# EAGLE design mainboard (EAGLE 6.4)
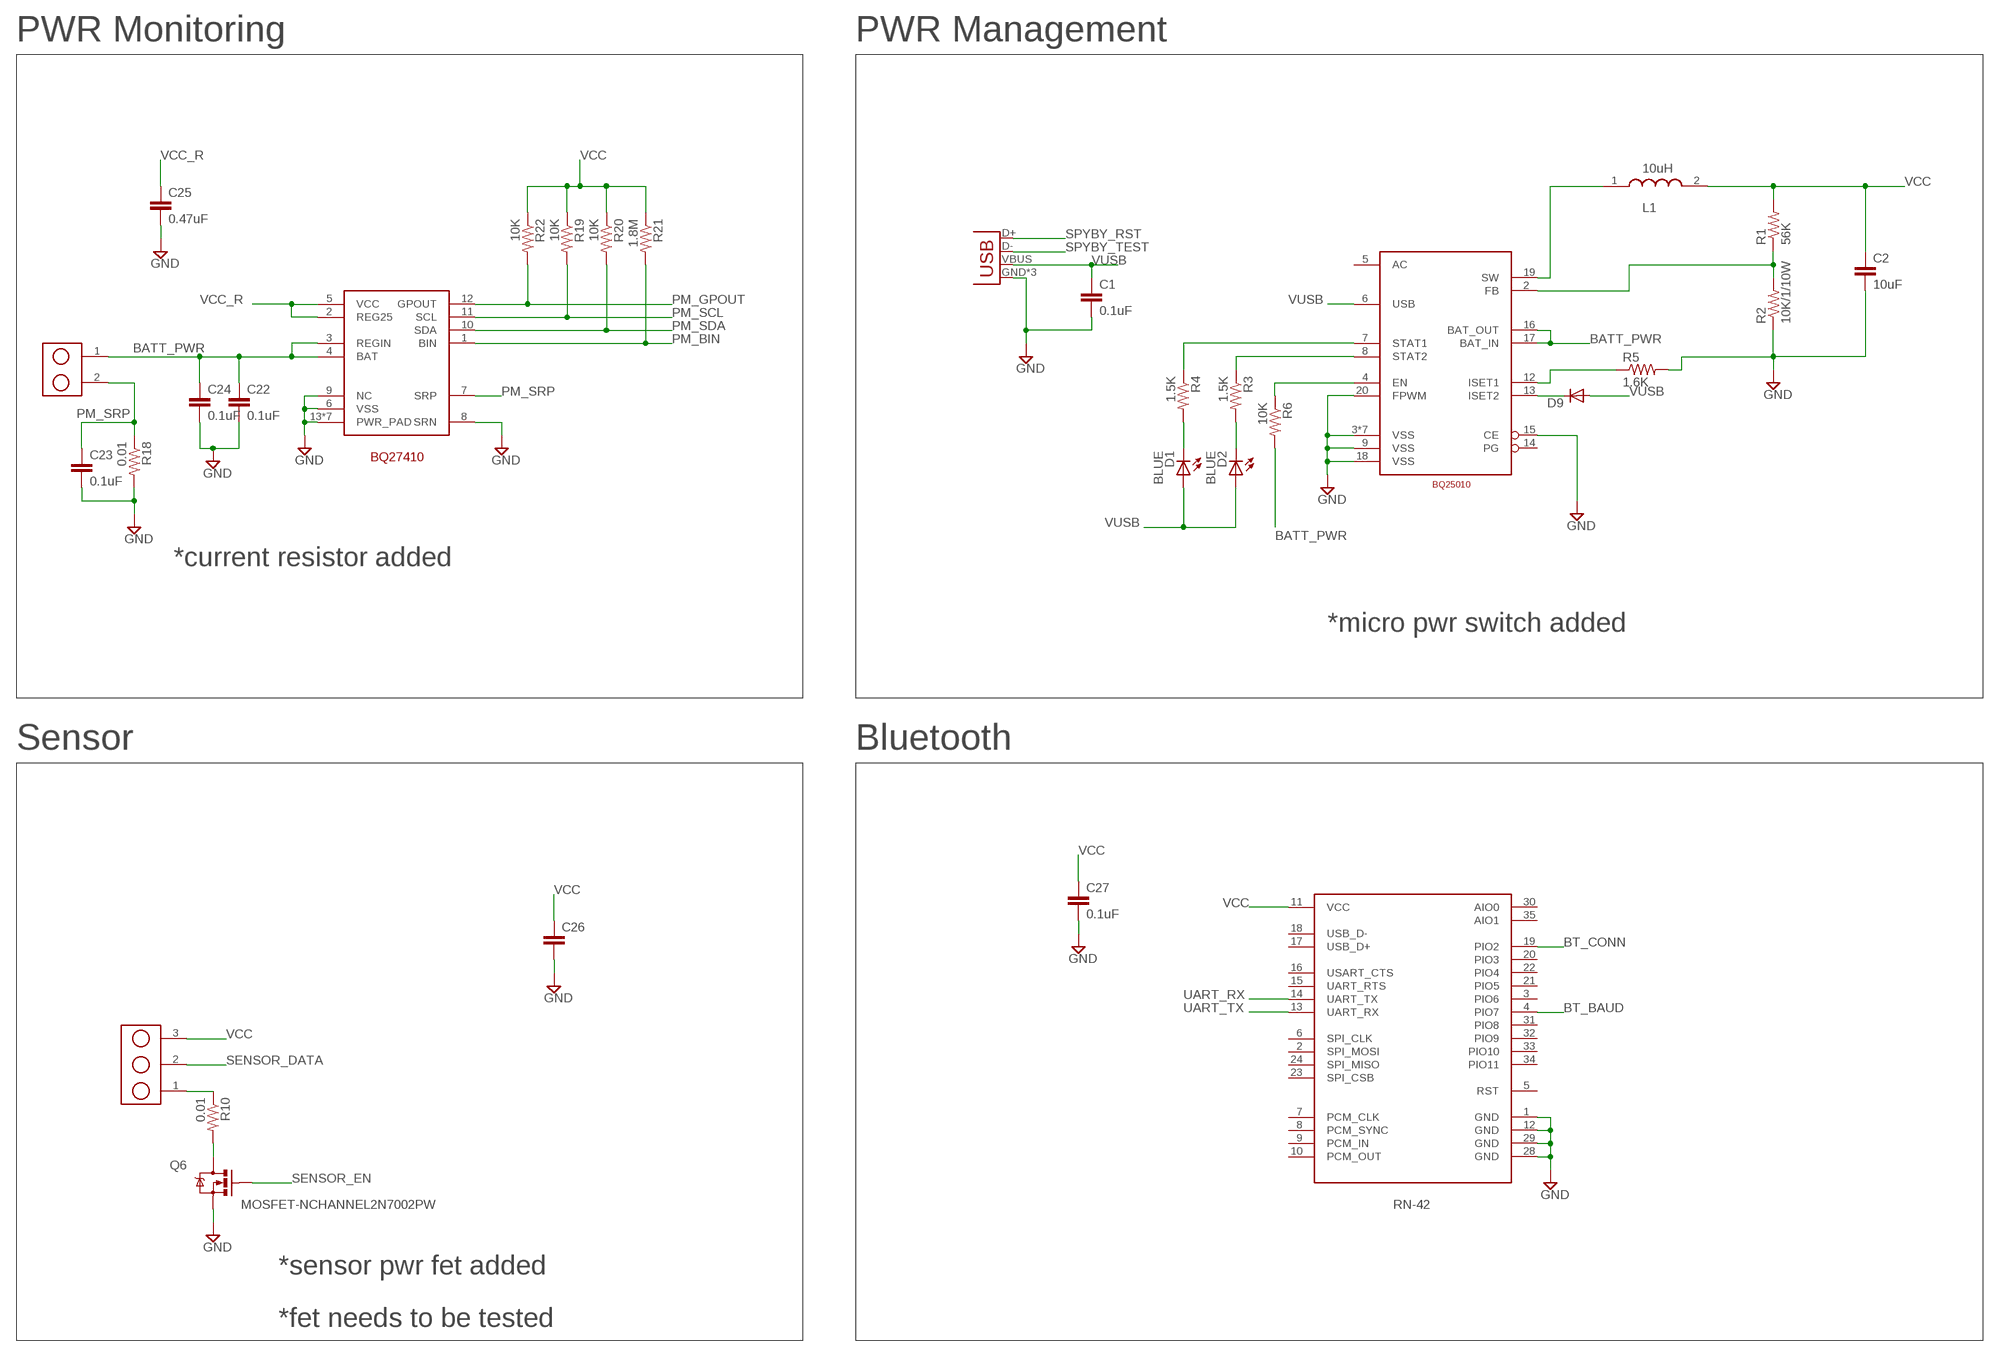
[diagram p0: schematic, sheet 1, part 1 of 2]
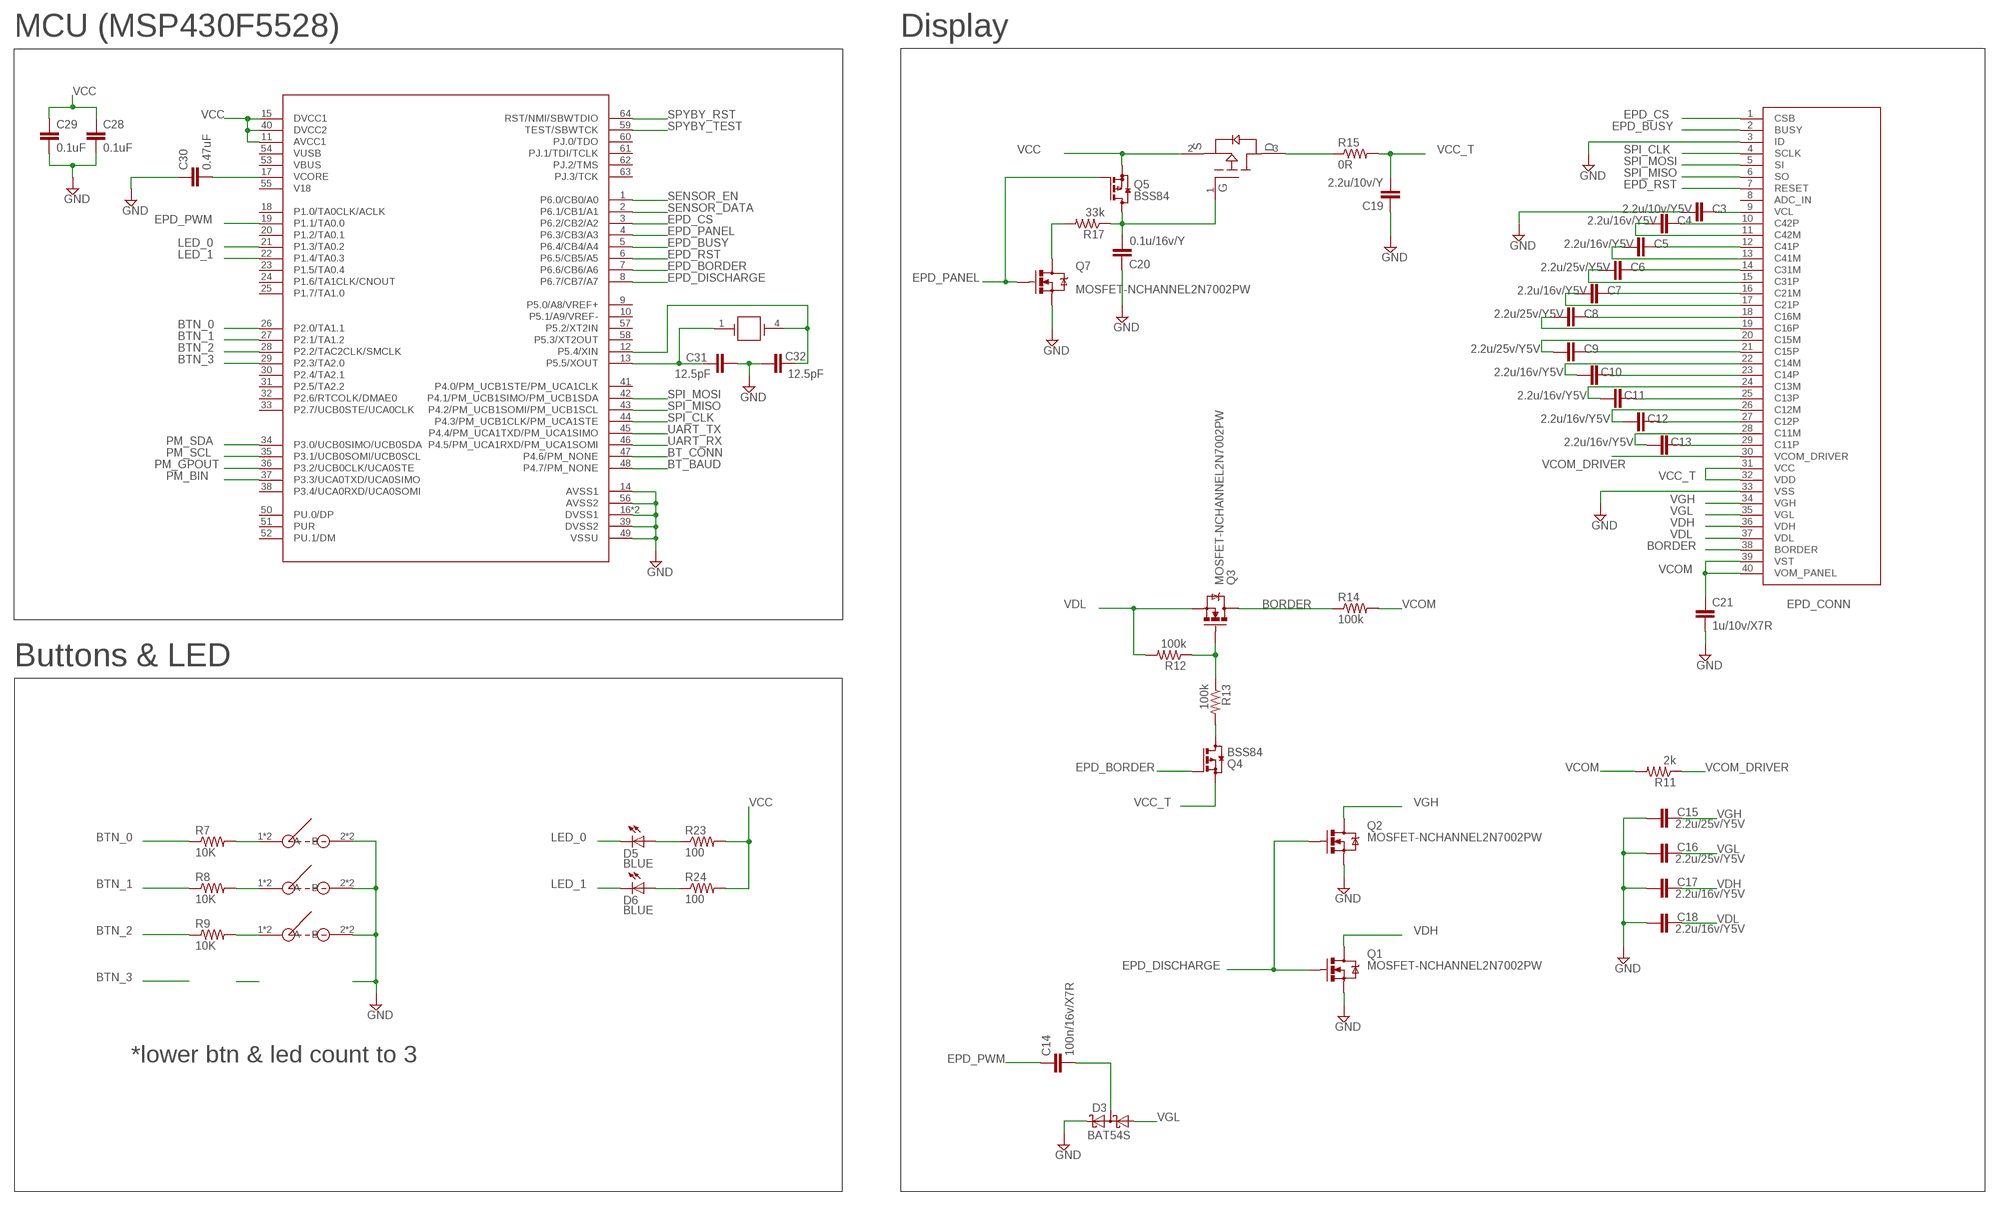
[diagram p1: schematic, sheet 1, part 2 of 2]

## Parts
AP2305  DMG2305UX  [SOT23]
C1  0.1uF  CAP0402-CAP  [0402-CAP]
C2  10uF  CAP0402-CAP  [0402-CAP]
C3  2.2u/10v/Y5V  CAP0402-CAP  [0402-CAP]
C4  2.2u/16v/Y5V  CAP0402-CAP  [0402-CAP]
C5  2.2u/16v/Y5V  CAP0402-CAP  [0402-CAP]
C6  2.2u/25v/Y5V  CAP0402-CAP  [0402-CAP]
C7  2.2u/16v/Y5V  CAP0402-CAP  [0402-CAP]
C8  2.2u/25v/Y5V  CAP0402-CAP  [0402-CAP]
C9  2.2u/25v/Y5V  CAP0402-CAP  [0402-CAP]
C10  2.2u/16v/Y5V  CAP0402-CAP  [0402-CAP]
C11  2.2u/16v/Y5V  CAP0402-CAP  [0402-CAP]
C12  2.2u/16v/Y5V  CAP0402-CAP  [0402-CAP]
C13  2.2u/16v/Y5V  CAP0402-CAP  [0402-CAP]
C14  100n/16v/X7R  CAP0402-CAP  [0402-CAP]
C15  2.2u/25v/Y5V  CAP0402-CAP  [0402-CAP]
C16  2.2u/25v/Y5V  CAP0402-CAP  [0402-CAP]
C17  2.2u/16v/Y5V  CAP0402-CAP  [0402-CAP]
C18  2.2u/16v/Y5V  CAP0402-CAP  [0402-CAP]
C19  2.2u/10v/Y  CAP0402-CAP  [0402-CAP]
C20  0.1u/16v/Y  CAP0402-CAP  [0402-CAP]
C21  1u/10v/X7R  CAP0402-CAP  [0402-CAP]
C22  0.1uF  CAP0402-CAP  [0402-CAP]
C23  0.1uF  CAP0402-CAP  [0402-CAP]
C24  0.1uF  CAP0402-CAP  [0402-CAP]
C25  0.47uF  CAP0402-CAP  [0402-CAP]
C26  CAP0402-CAP  [0402-CAP]
C27  0.1uF  CAP0402-CAP  [0402-CAP]
C28  0.1uF  CAP0402-CAP  [0402-CAP]
C29  0.1uF  CAP0402-CAP  [0402-CAP]
C30  0.47uF  CAP0402-CAP  [0402-CAP]
C31  12.5pF  CAP0402-CAP  [0402-CAP]
C32  12.5pF  CAP0402-CAP  [0402-CAP]
D1  BLUE  LED-BLUE0603  [LED-0603]
D2  BLUE  LED-BLUE0603  [LED-0603]
D3  BAT54S  [SOT23]
D5  BLUE  LED-BLUE0603  [LED-0603]
D6  BLUE  LED-BLUE0603  [LED-0603]
D9  DIODESOD523  [SOD523]
JP1  USB-MICROB  [USB-MICROB]
L1  10uH  ASPI-0428S-100M-T  [ASPI_0428S-100M-T]
Q1  MOSFET-NCHANNEL2N7002PW  [SOT323]
Q2  MOSFET-NCHANNEL2N7002PW  [SOT323]
Q3  MOSFET-NCHANNEL2N7002PW  [SOT323]
Q4  BSS84  [SOT23]
Q5  BSS84  [SOT23]
Q6  MOSFET-NCHANNEL2N7002PW  [SOT323]
Q7  MOSFET-NCHANNEL2N7002PW  [SOT323]
R1  56K  RESISTOR0402-RES  [0402-RES]
R2  10K/1/10W  RESISTOR0402-RES  [0402-RES]
R3  1.5K  RESISTOR0402-RES  [0402-RES]
R4  1.5K  RESISTOR0402-RES  [0402-RES]
R5  1.6K  RESISTOR0402-RES  [0402-RES]
R6  10K  RESISTOR0402-RES  [0402-RES]
R7  10K  RESISTOR0402-RES  [0402-RES]
R8  10K  RESISTOR0402-RES  [0402-RES]
R9  10K  RESISTOR0402-RES  [0402-RES]
R10  0.01  RESISTOR0402-RES  [0402-RES]
R11  2k  RESISTOR0402-RES  [0402-RES]
R12  100k  RESISTOR0402-RES  [0402-RES]
R13  100k  RESISTOR0402-RES  [0402-RES]
R14  100k  RESISTOR0402-RES  [0402-RES]
R15  0R  RESISTOR0402-RES  [0402-RES]
R17  33k  RESISTOR0402-RES  [0402-RES]
R18  0.01  RESISTOR0402-RES  [0402-RES]
R19  10K  RESISTOR0402-RES  [0402-RES]
R20  10K  RESISTOR0402-RES  [0402-RES]
R21  1.8M  RESISTOR0402-RES  [0402-RES]
R22  10K  RESISTOR0402-RES  [0402-RES]
R23  100  RESISTOR0402-RES  [0402-RES]
R24  100  RESISTOR0402-RES  [0402-RES]
U$1  MSP430F5528  [VQFN_RGC_64PIN]
U$2  RN-42  [RN-42]
U$3  BQ25010  [VQFN_RHL_20PIN]
U$4  RA_TAC_BUTTON"EVQPUK"  [EVQ-PUK02K]
U$5  RA_TAC_BUTTON"EVQPUK"  [EVQ-PUK02K]
U$6  RA_TAC_BUTTON"EVQPUK"  [EVQ-PUK02K]
U$8  FH12-40S-0.5SH  [FH12-40S-0.5SH]
U$9  BQ27410  [SON_DRZ_12PIN]
U$11  HEADER_2PIN_50MIL  [HEADER_2PIN_50MIL]
U$12  HEADER_3PIN_50MIL  [HEADER_3PIN_50MIL]
X1  CRYSTAL"32.768"  [ECS-327-12.5-17X-C-TR]

## Nets
BATT_PWR: C22.1 C24.1 R6.2 U$3.16(BAT_OUT) U$3.17(BAT_IN) U$9.3(REGIN) U$9.4(BAT) U$11.1
BORDER: Q3.3(D) R14.1 U$8.38(BORDER)
BT_BAUD: U$1.48(P4.7/PM_NONE) U$2.4(PIO7)
BT_CONN: U$1.47(P4.6/PM_NONE) U$2.19(PIO2)
BTN_0: R7.1 U$1.26(P2.0/TA1.1)
BTN_1: R8.1 U$1.27(P2.1/TA1.2)
BTN_2: R9.1 U$1.28(P2.2/TAC2CLK/SMCLK)
BTN_3: U$1.29(P2.3/TA2.0)
EPD_BORDER: Q4.1(G) U$1.7(P6.6/CB6/A6)
EPD_BUSY: U$1.5(P6.4/CB4/A4) U$8.2(BUSY)
EPD_CS: U$1.3(P6.2/CB2/A2) U$8.1(CSB)
EPD_DISCHARGE: Q1.1(G) Q2.1(G) U$1.8(P6.7/CB7/A7)
EPD_PANEL: Q5.1(G) Q7.1(G) U$1.4(P6.3/CB3/A3)
EPD_PWM: C14.1 U$1.19(P1.1/TA0.0)
EPD_RST: U$1.6(P6.5/CB5/A5) U$8.7(RESET)
GND: C1.2 C2.2 C3.1 C15.1 C16.1 C17.1 C18.1 C19.1 C20.1 C21.2 C22.2 C23.2 C24.2 C25.2 C26.2 C27.2 C28.2 C29.2 C30.1 C31.2 C32.1 D3.2(C2) JP1.GND JP1.MT1(GND) JP1.MT2(GND) Q1.2(S) Q2.2(S) Q6.2(S) Q7.2(S) R2.1 R5.2 R18.2 U$1.14(AVSS1) U$1.16(DVSS1) U$1.39(DVSS2) U$1.49(VSSU) U$1.56(AVSS2) U$1.P$1(DVSS1) U$2.1(GND) U$2.12(GND) U$2.28(GND) U$2.29(GND) U$3.3(VSS) U$3.9(VSS) U$3.15(CE) U$3.18(VSS) U$3.20(FPWM) U$3.P$21(VSS) U$3.P$22(VSS) U$3.P$23(VSS) U$3.P$24(VSS) U$3.P$25(VSS) U$3.P$26(VSS) U$4.2(B) U$4.4(B) U$5.2(B) U$5.4(B) U$6.2(B) U$6.4(B) U$8.3(ID) U$8.33(VSS) U$9.6(VSS) U$9.8(SRN) U$9.9(NC) U$9.13(PWR_PAD) U$9.P$15(PWR_PAD) U$9.P$16(PWR_PAD) U$9.P$17(PWR_PAD) U$9.P$18(PWR_PAD) U$9.P$19(PWR_PAD) U$9.P$20(PWR_PAD)
LED_0: D5.C U$1.21(P1.3/TA0.2)
LED_1: D6.C U$1.22(P1.4/TA0.3)
N$1: R5.1 U$3.12(ISET1)
N$2: D1.C R4.2
N$3: D9.C U$3.13(ISET2)
N$4: D2.C R3.2
N$5: R1.1 R2.2 U$3.2(FB)
N$6: L1.1 U$3.19(SW)
N$7: C30.2 U$1.17(VCORE)
N$8: Q4.3(D) R13.2
N$9: C14.2 D3.3(C1A2)
N$10: R4.1 U$3.7(STAT1)
N$11: R3.1 U$3.8(STAT2)
N$12: R6.1 U$3.4(EN)
N$13: R7.2 U$4.1(A) U$4.3(A)
N$14: R8.2 U$5.1(A) U$5.3(A)
N$15: R9.2 U$6.1(A) U$6.3(A)
N$17: Q6.3(D) R10.2
N$19: R10.1 U$12.1
N$26: C4.2 U$8.10(C42P)
N$27: C4.1 U$8.11(C42M)
N$28: C5.2 U$8.12(C41P)
N$29: C5.1 U$8.13(C41M)
N$30: C6.2 U$8.14(C31M)
N$31: C6.1 U$8.15(C31P)
N$32: C7.2 U$8.16(C21M)
N$33: C7.1 U$8.17(C21P)
N$34: C8.2 U$8.18(C16M)
N$35: C8.1 U$8.19(C16P)
N$36: C9.1 U$8.20(C15M)
N$37: C9.2 U$8.21(C15P)
N$38: C10.1 U$8.22(C14M)
N$39: C10.2 U$8.23(C14P)
N$40: C11.1 U$8.24(C13M)
N$41: C11.2 U$8.25(C13P)
N$42: C12.1 U$8.26(C12M)
N$43: C12.2 U$8.27(C12P)
N$44: C13.1 U$8.28(C11M)
N$45: C13.2 U$8.29(C11P)
N$46: C3.2 U$8.9(VCL)
N$47: AP2305.3(DRAIN) R15.1
N$48: D5.A R23.1
N$49: Q3.1(G) R12.1 R13.1
N$50: AP2305.1(GATE) C20.2 Q5.3(D) R17.1
N$51: D6.A R24.1
N$52: Q7.3(D) R17.2
PM_BIN: R21.2 U$1.37(P3.3/UCA0TXD/UCA0SIMO) U$9.1(BIN)
PM_GPOUT: R22.2 U$1.36(P3.2/UCB0CLK/UCA0STE) U$9.12(GPOUT)
PM_SCL: R19.2 U$1.35(P3.1/UCB0SOMI/UCB0SCL) U$9.11(SCL)
PM_SDA: R20.2 U$1.34(P3.0/UCB0SIMO/UCB0SDA) U$9.10(SDA)
PM_SRP: C23.1 R18.1 U$9.7(SRP) U$11.2
SENSOR_DATA: U$1.2(P6.1/CB1/A1) U$12.2
SENSOR_EN: Q6.1(G) U$1.1(P6.0/CB0/A0)
SPI_CLK: U$1.44(P4.3/PM_UCB1CLK/PM_UCA1STE) U$8.4(SCLK)
SPI_MISO: U$1.43(P4.2/PM_UCB1SOMI/PM_UCB1SCL) U$8.6(SO)
SPI_MOSI: U$1.42(P4.1/PM_UCB1SIMO/PM_UCB1SDA) U$8.5(SI)
SPYBY_RST: JP1.D+ U$1.64(RST/NMI/SBWTDIO)
SPYBY_TEST: JP1.D- U$1.59(TEST/SBWTCK)
UART_RX: U$1.46(P4.5/PM_UCA1RXD/PM_UCA1SOMI) U$2.14(UART_TX)
UART_TX: U$1.45(P4.4/PM_UCA1TXD/PM_UCA1SIMO) U$2.13(UART_RX)
VCC: AP2305.2(SOURCE) C2.1 C26.1 C27.1 C28.1 C29.1 L1.2 Q5.2(S) R1.2 R19.1 R20.1 R21.1 R22.1 R23.2 R24.2 U$1.11(AVCC1) U$1.15(DVCC1) U$1.40(DVCC2) U$2.11(VCC) U$12.3
VCC_R: C25.1 U$9.2(REG25) U$9.5(VCC)
VCC_T: C19.2 Q4.2(S) R15.2 U$8.31(VCC) U$8.32(VDD)
VCOM: C21.1 R11.2 R14.2 U$8.39(VST) U$8.40(VOM_PANEL)
VCOM_DRIVER: R11.1 U$8.30(VCOM_DRIVER)
VDH: C17.2 Q1.3(D) U$8.36(VDH)
VDL: C18.2 Q3.2(S) R12.2 U$8.37(VDL)
VGH: C15.2 Q2.3(D) U$8.34(VGH)
VGL: C16.2 D3.1(A1) U$8.35(VGL)
VUSB: C1.1 D1.A D2.A D9.A JP1.VBUS U$3.6(USB)
XIN: C32.2 U$1.12(P5.4/XIN) X1.4
XOUT: C31.1 U$1.13(P5.5/XOUT) X1.1
Unconnected: U$1.9(P5.0/A8/VREF+) U$1.10(P5.1/A9/VREF-) U$1.18(P1.0/TA0CLK/ACLK) U$1.20(P1.2/TA0.1) U$1.23(P1.5/TA0.4) U$1.24(P1.6/TA1CLK/CNOUT) U$1.25(P1.7/TA1.0) U$1.30(P2.4/TA2.1) U$1.31(P2.5/TA2.2) U$1.32(P2.6/RTCOLK/DMAE0) U$1.33(P2.7/UCB0STE/UCA0CLK) U$1.38(P3.4/UCA0RXD/UCA0SOMI) U$1.41(P4.0/PM_UCB1STE/PM_UCA1CLK) U$1.50(PU.0/DP) U$1.51(PUR) U$1.52(PU.1/DM) U$1.53(VBUS) U$1.54(VUSB) U$1.55(V18) U$1.57(P5.2/XT2IN) U$1.58(P5.3/XT2OUT) U$1.60(PJ.0/TDO) U$1.61(PJ.1/TDI/TCLK) U$1.62(PJ.2/TMS) U$1.63(PJ.3/TCK) U$2.2(SPI_MOSI) U$2.3(PIO6) U$2.5(RST) U$2.6(SPI_CLK) U$2.7(PCM_CLK) U$2.8(PCM_SYNC) U$2.9(PCM_IN) U$2.10(PCM_OUT) U$2.15(UART_RTS) U$2.16(USART_CTS) U$2.17(USB_D+) U$2.18(USB_D-) U$2.20(PIO3) U$2.21(PIO5) U$2.22(PIO4) U$2.23(SPI_CSB) U$2.24(SPI_MISO) U$2.30(AIO0) U$2.31(PIO8) U$2.32(PIO9) U$2.33(PIO10) U$2.34(PIO11) U$2.35(AIO1) U$3.5(AC) U$3.14(PG) U$8.8(ADC_IN)

## Notes on the sheet
- PWR Monitoring | PWR Management | MCU (MSP430F5528) | Display
- 10uH
- L1
- *current resistor added
- *micro pwr switch added
- Sensor | Bluetooth | Buttons & LED
- *lower btn & led count to 3
- *sensor pwr fet added
- *fet needs to be tested

## Library data of the parts
AP2305 = TuansLib:DMG2305UX
C1-C32 = SparkFun-Capacitors:CAP: Capacitor Standard 0603 ceramic capacitor, and 0.1" leaded capacitor.
D1 D2 D5 D6 = SparkFun-LED:LED-BLUE: Blue LEDs for production use Various blue LEDs stocked by SparkFun production 0603 - DIO-08575 Rebel - DIO-09553 1206 - DIO-09911; PROD_ID: DIO-08575
D3 = diode:BAT54S: Schottky Diodes Pin connection corrected 2011-05-04 Source: Fairchild .. BAT54.pdf
D9 = SparkFun-DiscreteSemi:DIODE: Diode These are standard reverse protection diodes and small signal diodes. SMA package can handle up to about 1A. SOD-323 can handle about 200mA. What the SOD-323 package when ordering, there are some mfgs out there that are 5-pin packages.
JP1 = SparkFun-Connectors:USB: USB Connectors USB-B-PTH is fully proven SKU : PRT-00139/CONN-08278 USB-miniB is fully proven SKU : PRT-00587 USB-A-PCB is untested. USB-A-H is throughly reviewed, but untested. Spark Fun Electronics SKU : PRT-00437 USB-B-SMT is throughly reviewed, but untested. Needs silkscreen touching up. USB-A-S has not been used/tested USB-MB-H has not been used/tested USB-MICROB has been used. CONN-09505; PROD_ID: CONN-09505
L1 = TuansLib:ASPI-0428S-100M-T
Q1-Q3 Q6 Q7 = SparkFun-DiscreteSemi:MOSFET-NCHANNEL: Common NMOSFET Parts MFG P/N Store ID Prod ID FDD8780 TRANS-09984 SI7820DN TRANS-11055 FDS6630A IC-08089 2N7002PW TRANS-11151 FQP30N06L COM-10213 TRANS-10060 BSS123LT1G TRANS-08345 BSS138 TRANS-00830 BS170 2N7000; PROD_ID: TRANS-11151
Q4 Q5 = transistor-small-signal:BSS84: P-CHANNEL MOS FET
R1-R15 R17-R24 = SparkFun-Passives:RESISTOR: Resistor Basic schematic elements and footprints for 0603, 1206, and PTH resistors.
U$1 = TuansLib:MSP430F5528
U$2 = TuansLib:RN-42
U$3 = TuansLib:BQ25010
U$4-U$6 = TuansLib:RA_TAC_BUTTON; PART#: EVQ-PUK02K
U$8 = TuansLib:FH12-40S-0.5SH
U$9 = TuansLib:BQ27410
U$11 = TuansLib:HEADER_2PIN_50MIL
U$12 = TuansLib:HEADER_3PIN_50MIL
X1 = TuansLib:CRYSTAL

## Board
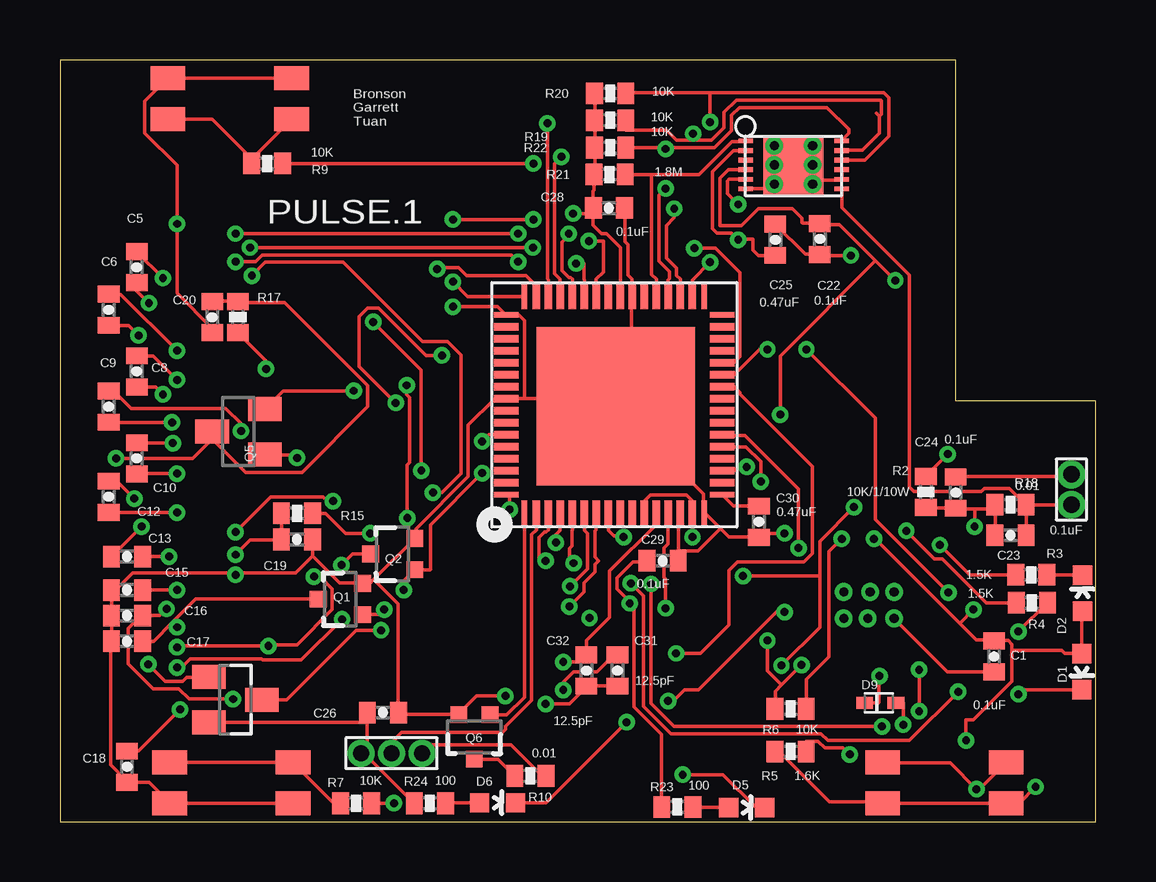
[diagram p2: board, top side]
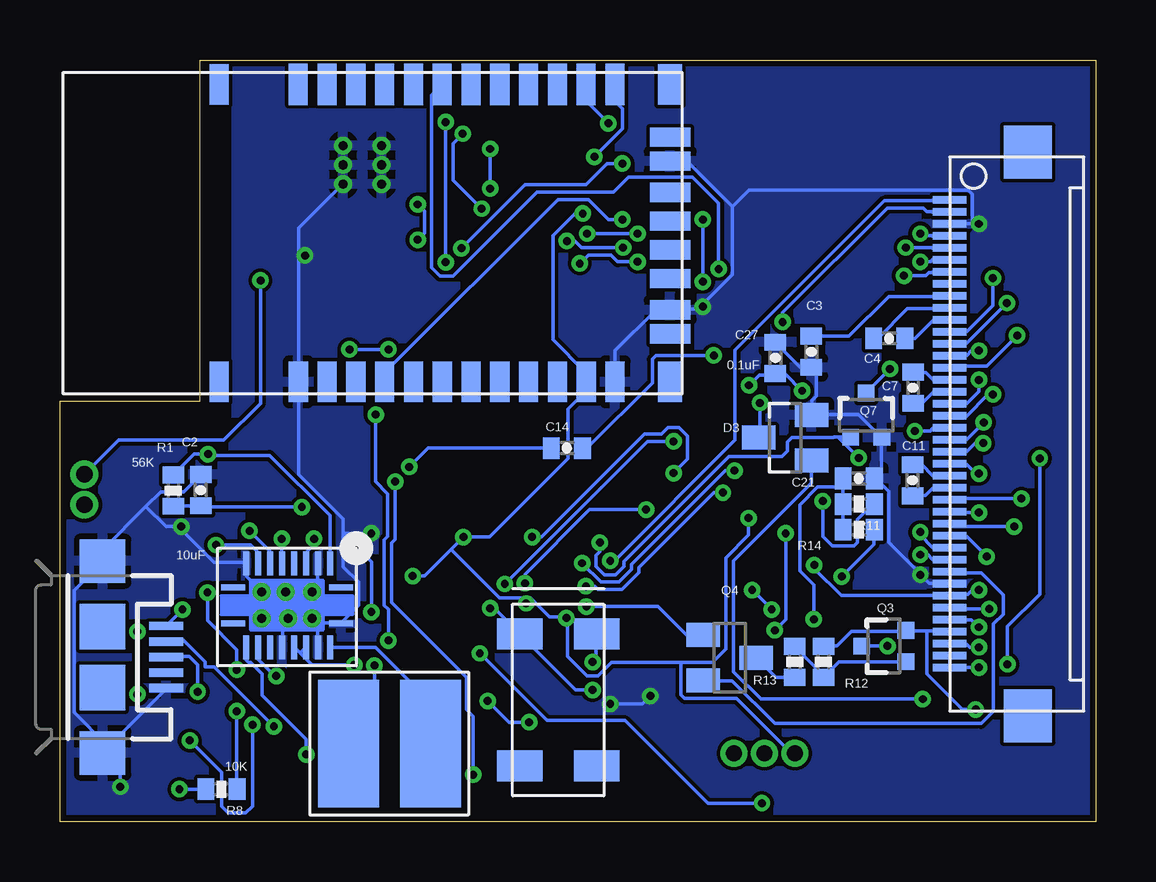
[diagram p3: board, bottom side, seen from below]

Size 43.18 x 31.75 mm. Coordinates in mm from the lower left corner, seen from the top.
Outline: 37.34,31.75 0,31.75 0,0 43.18,0 43.18,17.53 37.34,17.53 37.34,31.75
Copper layers (1*16): Top 0.035mm / dielectric 1.5mm / Bottom 0.035mm
Design rules "default *": minimum track width 6mil, minimum drill 13mil, track to track 6mil, track to pad 6mil, pad to pad 6mil, via to via 6mil, smd to smd 6mil, copper to edge 10mil, drill to drill 8mil, minimum pad ring 7mil, minimum via ring 7mil, stop-mask expansion 4mil, vias tented up to drill 0mil, thermal gap 10mil

### Footprints (pad centres in the part's own frame; a part is rotated, then mirrored left to right if it is on the bottom)
SOT23 = smd 1 x 1.4: 1 -0.95,-1.1; 2 0.95,-1.1; 3 0,1.1
0402-CAP = smd 0.7 x 0.9: 1 -0.65,0; 2 0.65,0
LED-0603 = smd 0.8 x 0.8: A 0,-0.75; C 0,0.75
SOD523 = smd 0.7 x 0.5: A 0.7,0; C -0.6,0
USB-MICROB = smd 0.35 x 1.4: D+ 0,2.65; D- -0.65,2.65; GND 1.3,2.65; ID 0.65,2.65; VBUS -1.3,2.65 | smd 1.8 x 1.9: MT1 -4,0; MT2 4,0 | smd 1.9 x 1.9: P$1 -1.27,0; P$2 1.27,0
ASPI_0428S-100M-T = smd 5.309 x 2.54: 1 0,0; 2 0,3.404
SOT323 = smd 0.7 x 0.7: 1 -0.65,-0.925; 2 0.65,-0.925; 3 0,0.925
0402-RES = smd 0.7 x 0.9: 1 -0.65,0; 2 0.65,0
VQFN_RGC_64PIN = smd 1.016 x 0.229: 1 0,8.25; 16 0,0.75; 33 9,0.75; 48 9,8.25 | smd 1.016 x 0.305: 2 0,7.75; 3 0,7.25; 4 0,6.75; 5 0,6.25; 6 0,5.75; 7 0,5.25; 8 0,4.75; 9 0,4.25; 10 0,3.75; 11 0,3.25; 12 0,2.75; 13 0,2.25; 14 0,1.75; 15 0,1.25; 34 9,1.25; 35 9,1.75; 36 9,2.25; 37 9,2.75; 38 9,3.25; 39 9,3.75; 40 9,4.25; 41 9,4.75; 42 9,5.25; 43 9,5.75; 44 9,6.25; 45 9,6.75; 46 9,7.25; 47 9,7.75 | smd 0.229 x 1.016: 17 0.75,0; 32 8.25,0; 49 8.25,9; 64 0.75,9 | smd 0.305 x 1.016: 18 1.25,0; 19 1.75,0; 20 2.25,0; 21 2.75,0; 22 3.25,0; 23 3.75,0; 24 4.25,0; 25 4.75,0; 26 5.25,0; 27 5.75,0; 28 6.25,0; 29 6.75,0; 30 7.25,0; 31 7.75,0; 50 7.75,9; 51 7.25,9; 52 6.75,9; 53 6.25,9; 54 5.75,9; 55 5.25,9; 56 4.75,9; 57 4.25,9; 58 3.75,9; 59 3.25,9; 60 2.75,9; 61 2.25,9; 62 1.75,9; 63 1.25,9 | smd 6.604 x 6.604: P$1 4.445,4.445
RN-42 = smd 1.7 x 0.8: 1 0.5,16; 2 0.5,14.8; 3 0.5,13.6; 4 0.5,12.4; 5 0.5,11.2; 6 0.5,10; 7 0.5,8.8; 8 0.5,7.6; 9 0.5,6.4; 10 0.5,5.2; 11 0.5,4; 12 0.5,2.8; 13 12.9,2.8; 14 12.9,4; 15 12.9,5.2; 16 12.9,6.4; 17 12.9,7.6; 18 12.9,8.8; 19 12.9,10; 20 12.9,11.2; 21 12.9,12.4; 22 12.9,13.6; 23 12.9,14.8; 24 12.9,16; P$35 0.5,19.3; P$36 12.9,19.3 | smd 0.8 x 1.7: 28 9.7,0.5; 29 3.5,0.5; 30 10.7,0.5; 31 8.4,0.5; 32 7.2,0.5; 33 6,0.5; 34 4.8,0.5; 35 2.5,0.5 | smd 1.7 x 1: P$33 0.5,0.5; P$34 12.9,0.5
VQFN_RHL_20PIN = smd 1 x 0.25: 1 0,1; 10 4.5,1; 11 4.5,2.5; 20 0,2.5 | smd 0.25 x 1: 2 0.45,0; 3 0.95,0; 4 1.45,0; 5 1.95,0; 6 2.45,0; 7 2.95,0; 8 3.45,0; 9 3.95,0; 12 3.95,3.5; 13 3.45,3.5; 14 2.95,3.5; 15 2.45,3.5; 16 1.95,3.5; 17 1.45,3.5; 18 0.95,3.5; 19 0.45,3.5 | drill 0.381: P$21 1.2,2.3; P$22 1.2,1.2; P$23 2.3,1.2; P$24 2.2,2.3; P$25 3.3,2.3; P$26 3.3,1.2
EVQ-PUK02K = smd 1.45 x 1: 1 5.15,1.7; 2 5.15,0; 3 0,1.7; 4 0,0
FH12-40S-0.5SH = smd 0.31 x 1.4: 1 0,0; 2 0.5,0; 3 1,0; 4 1.5,0; 5 2,0; 6 2.5,0; 7 3,0; 8 3.5,0; 9 4,0; 10 4.5,0; 11 5,0; 12 5.5,0; 13 6,0; 14 6.5,0; 15 7,0; 16 7.5,0; 17 8,0; 18 8.5,0; 19 9,0; 20 9.5,0; 21 10,0; 22 10.5,0; 23 11,0; 24 11.5,0; 25 12,0; 26 12.5,0; 27 13,0; 28 13.5,0; 29 14,0; 30 14.5,0; 31 15,0; 32 15.5,0; 33 16,0; 34 16.5,0; 35 17,0; 36 17.5,0; 37 18,0; 38 18.5,0; 39 19,0; 40 19.5,0 | smd 2.2 x 2: G@0 -2,3.25; G@1 21.5,3.25
SON_DRZ_12PIN = smd 0.2 x 0.6: 1 0.2,0; 2 0.6,0; 3 1,0; 4 1.4,0; 5 1.8,0; 6 2.2,0; 7 2.2,4; 8 1.8,4; 9 1.4,4; 10 1,4; 11 0.6,4; 12 0.2,4 | smd 2.5 x 2.5: 13 1.25,2 | drill 0.381: P$15 0.4,2.8; P$16 1.2,2.8; P$17 2,2.8; P$18 2,1.2; P$19 1.2,1.2; P$20 0.4,1.2
HEADER_2PIN_50MIL = drill 0.686 pad 0.889: 1 1.27,1.27; 2 1.27,2.54
HEADER_3PIN_50MIL = drill 0.66 pad 0.889: 1 1.27,1.27; 2 1.27,2.54; 3 1.27,3.81
ECS-327-12.5-17X-C-TR = smd 1.3 x 1.9: 1 1.25,0.3; 2 6.75,0.3; 3 6.75,3.5; 4 1.25,3.5

### Placement (x,y rotation side)
AP2305  7.32,5.08 270 top
C1  38.94,6.88 270 top
C2  37.31,13.82 90 bottom
C3  11.86,19.58 90 bottom
C4  8.61,20.14 180 bottom
C5  3.2,23.11 90 top
C6  2.03,21.34 90 top
C7  7.62,18.08 90 bottom
C8  3.2,18.77 90 top
C9  2.03,17.3 270 top
C10  3.2,15.14 270 top
C11  7.65,14.22 270 bottom
C12  2.03,13.54 270 top
C13  2.79,11.05 0 top
C14  22.05,15.57 0 bottom
C15  2.79,9.65 0 top
C16  2.79,8.59 0 top
C17  2.79,7.52 0 top
C18  2.79,2.29 90 top
C19  9.88,11.76 180 top
C20  6.35,21.03 90 top
C21  9.88,14.3 0 bottom
C22  31.67,24.28 270 top
C23  39.62,11.94 180 top
C24  37.34,13.72 270 top
C25  29.82,24.26 90 top
C26  13.46,4.55 0 top
C27  13.36,19.33 90 bottom
C28  22.89,25.58 0 top
C29  25.12,10.87 0 top
C30  29.13,12.5 90 top
C31  23.24,6.3 270 top
C32  21.95,6.3 90 top
D1  42.6,6.25 180 top
D2  42.62,9.53 0 top
D3  12.95,16 90 bottom
D5  28.63,0.58 270 top
D6  18.24,0.79 270 top
D9  34.14,4.95 0 top
JP1  41.4,6.86 270 bottom
L1  27.74,3.25 90 bottom
Q1  11.68,9.27 90 top
Q2  13.87,11.15 90 top
Q3  8.84,7.32 90 bottom
Q4  15.27,6.83 270 bottom
Q5  7.44,16.26 90 top
Q6  17.27,3.53 180 top
Q7  9.58,16.94 0 bottom
R1  38.46,13.79 270 bottom
R2  36.09,13.74 90 top
R3  40.49,10.29 0 top
R4  40.51,9.12 0 top
R5  30.45,2.92 180 top
R6  30.45,4.7 180 top
R7  12.34,0.76 180 top
R8  36.45,1.35 180 bottom
R9  8.64,27.43 180 top
R10  19.61,1.91 180 top
R11  9.88,13.23 180 bottom
R12  11.35,6.65 90 bottom
R13  12.55,6.65 270 bottom
R14  9.88,12.17 180 bottom
R15  9.88,12.85 180 top
R17  7.42,21.03 270 top
R18  39.62,13.21 180 top
R19  22.94,29.24 0 top
R20  22.94,30.35 0 top
R21  22.91,26.97 0 top
R22  22.94,28.09 0 top
R23  25.73,0.61 180 top
R24  15.42,0.76 180 top
U$1  27.61,12.88 90 top
U$2  17.25,17.83 90 bottom
U$3  31.47,10.77 180 bottom
U$4  4.57,0.76 0 top
U$5  34.29,0.76 0 top
U$6  9.65,30.99 180 top
U$8  6.1,25.91 270 bottom
U$9  28.57,28.57 270 top
U$11  43.43,15.75 180 top
U$12  16.36,1.57 90 top
X1  24.31,9.07 270 bottom

### Tracks (layer width: path | path; a pad name or v marks a point on that pad's centre or on a via)
BATT_PWR  (via drill 0.33)
  Top 0.152: v30.91,6.53 30.07,5.69 | 30.07,5.69 29.82,5.44 29.82,4.7 R6.2 | U$9.3 U$9.4 28.52,27.18 27.86,27.18 27.51,26.82 27.51,24.84 28.4,24.84 29.11,25.55 30.53,25.55 30.94,25.15 30.94,24.97 30.96,24.94 31.6,24.94 C22.1 31.73,24.89 32.49,24.89 34,23.38 | U$11.1 42.06,14.38 C24.1 | v34.82,22.55 34,23.38 | 30.07,5.69 29.49,6.27 v29.49,7.54 | v30.02,16.97 30.02,19.41 34,23.38
  Bottom 0.152: v30.91,6.53 32.66,6.53 33.17,7.04 | 33.17,7.04 33.4,7.26 U$3.16 | 33.17,7.04 32.94,7.26 U$3.17 | v34.82,22.55 34.82,17.42 36.35,15.9 40.74,15.9 U$11.1 | v29.49,7.54 29.49,8.84 29.67,9.02 29.67,11.73 29.52,11.89 29.52,13.66 30.02,14.17 v30.02,16.97
BORDER  (via drill 0.33)
  Top 0.152: v4.88,7.26 4.93,7.32 v8.69,7.32 8.74,7.37 9.88,7.37 11.35,8.84 11.35,9.7 10.85,10.21 v10.59,10.21
  Bottom 0.152: v8.69,7.32 Q3.3 | v4.88,7.26 5.26,7.26 5.38,7.39 6.1,7.39 U$8.38 | v10.59,10.21 9.25,11.56 9.25,12.17 R14.1
BT_BAUD  (via drill 0.33)
  Top 0.152: v16.38,22.5 16.99,21.89 19.36,21.89 U$1.48 | v19.74,25.09 v16.38,25.09
  Bottom 0.152: v16.38,25.09 v16.38,22.5 | v19.74,25.09 20.32,25.09 21.16,25.93 22.43,25.93 29.64,18.72 U$2.4
BT_CONN  (via drill 0.33)
  Top 0.152: v15.72,23.04 15.77,23.09 16.61,23.09 16.94,22.76 19.43,22.76 19.84,22.35 19.84,21.89 U$1.47
  Bottom 0.152: v15.72,23.04 15.72,25.78 16.82,26.87 19.48,26.87 20.12,26.24 23.29,26.24 26.8,22.73 27.33,22.73 27.69,23.09 27.69,30.28 27.25,30.71 U$2.19
BTN_0  (via drill 0.33)
  Top 0.152: v13.92,0.76 R7.1 | v25.68,7.01 26.7,7.01 27.89,8.2 27.89,10.46 28.25,10.82 31.01,10.82 31.37,11.18 31.37,14.81 28.35,17.83 28.35,17.88 28.12,18.11 27.61,18.11 U$1.26
  Bottom 0.152: v13.92,0.76 16.18,0.76 19.63,4.22 22.89,4.22 v25.68,7.01
BTN_1  (via drill 0.33)
  Top 0.152: v35.81,6.33 v35.81,4.6 | v37.03,9.55 33.98,12.6 33.98,16.82 v31.11,19.68 | v29.49,19.68 29.16,19.68 28.12,18.64 27.61,18.64 U$1.27
  Bottom 0.152: v35.81,4.6 35.81,1.35 R8.1 | v35.81,6.33 35.81,7.16 37.03,8.38 v37.03,9.55 | v29.49,19.68 v31.11,19.68
BTN_2  (via drill 0.33)
  Top 0.152: v19.74,27.43 R9.1 | v26.44,23.9 27.33,23.9 28.35,22.89 28.35,19.38 28.12,19.15 27.61,19.15 U$1.28
  Bottom 0.152: v19.74,27.43 20.37,27.43 21.26,26.54 23.8,26.54 v26.44,23.9
EPD_BORDER  (via drill 0.33 pad 0.51)
  Top 0.152: U$1.7 22.35,12.17 22.3,12.12 22.3,11.02 22.45,10.87 22.3,10.72 22.3,10.41 21.84,9.96 21.84,9.58 v21.23,8.97
  Bottom 0.152: v21.23,8.97 18.26,8.97 17.07,7.77 16.38,7.77 Q4.1
EPD_BUSY  (via drill 0.33 pad 0.51)
  Top 0.152: U$1.5 21.36,12.17 21.34,12.14 21.34,11.48 21.23,11.38 21.23,10.95 v21.41,10.77 | v15.06,14.63 15.06,18.82 v13.06,20.83
  Bottom 0.152: v21.41,10.77 20.62,9.98 19.89,9.98 19.36,10.52 19.36,10.72 15.44,14.63 v15.06,14.63 | v13.06,20.83 13.06,21.21 8.69,25.58 7.19,25.58 7.04,25.43 6.83,25.43 6.81,25.4 U$8.2
EPD_CS  (via drill 0.33 pad 0.51)
  Top 0.152: U$1.3 20.37,12.17 20.27,12.06 20.19,12.06 19.96,11.84 19.96,11 20.09,10.87 v20.24,10.87
  Bottom 0.152: v20.24,10.87 20.07,10.87 15.04,15.9 15.04,19.66 8.81,25.88 6.83,25.88 6.81,25.91 U$8.1
EPD_DISCHARGE  (via drill 0.33, 0.33 pad 0.51)
  Top 0.152: v13.51,8.84 13.31,8.64 12.62,8.64 Q1.1 | v14.33,9.65 14.33,10.03 Q2.1 14.86,10.49 15.42,10.49 15.44,10.52 15.44,12.37 v17.6,14.53 | 23.55,11.91 23.09,11.91 22.86,12.14 U$1.8 | U$1.8 | 23.55,11.91 23.7,11.91 | v23.5,11.86 23.55,11.91
  Bottom 0.152: v14.33,9.65 v13.51,8.84 | v23.5,11.86 23.11,11.86 18.82,16.15 18.11,16.15 17.83,16.43 17.37,16.43 17.02,16.08 17.02,15.11 v17.6,14.53
EPD_PANEL  (via drill 0.33, 0.33 pad 0.51)
  Top 0.152: U$1.4 20.85,12.14 20.55,11.84 20.55,11.63 v20.68,11.63 | v9.88,15.16 9.75,15.29 8.56,15.29 Q5.1
  Bottom 0.152: v20.68,11.63 20.68,11.25 20.83,11.1 20.83,10.64 20.47,10.29 20.02,10.29 19.66,10.64 19.66,10.85 15.29,15.21 13.08,15.21 12.85,15.44 12.85,15.82 12.68,16 10.95,16 10.92,16.03 10.69,16.03 | 10.69,16.03 Q7.1 | v9.88,15.16 10.69,15.98 10.69,16.03
EPD_PWM  (via drill 0.33)
  Top 0.152: v28.63,14.78 28.27,14.78 28.12,14.63 U$1.19
  Bottom 0.152: C14.1 27.84,15.57 v28.63,14.78
EPD_RST  (via drill 0.33 pad 0.51)
  Top 0.152: U$1.6 21.87,12.14 22,12.01 22,10.54 21.51,10.06 21.26,10.06 v21.26,9.8 | v15.54,13.72 15.93,13.72 16.71,14.5 16.71,19.46 16.15,20.02 15.11,20.02 11.81,23.32 8.56,23.32 v8,22.76
  Bottom 0.152: v21.26,9.8 20.88,9.8 20.75,9.68 19.76,9.68 19.05,10.39 19.05,10.59 15.93,13.72 v15.54,13.72 | v8,22.76 7.09,22.76 6.96,22.89 6.83,22.89 6.81,22.91 U$8.7
GND  (via drill 0.33)
  Top 0.152: C28.2 23.55,24.18 23.67,24.05 23.67,22.78 23.85,22.61 23.85,21.89 U$1.39 23.82,21.82 23.82,18.59 22.91,17.68 U$1.P$1 | C25.2 29.82,24.89 31.06,23.65 31.67,23.65 C22.2 31.73,23.6 v32.97,23.6 | U$9.9 32.59,27.15 32.59,26.8 U$9.8 32.51,26.75 31.55,26.75 31.39,26.59 U$9.13 | U$9.6 29.59,26.39 U$9.P$18 U$9.13 | U$9.P$18 29.77,26.59 U$9.13 | U$9.13 30.15,27 U$9.P$19 29.77,27.43 U$9.P$20 | U$9.P$17 31.37,26.59 U$9.13 | U$9.13 31.01,27 31.37,27.36 U$9.P$16 31.37,27.43 U$9.P$15 | v40.66,1.45 40.01,0.79 39.5,0.79 U$5.2 U$5.4 34.24,0.81 32.08,0.81 29.97,2.92 R5.2 | C23.2 38.99,11.94 38.99,13.21 R18.2 38.94,13.03 38.12,13.03 | R2.1 C24.2 37.39,13.03 38.12,13.03 | v38.12,12.29 38.12,13.03 | C1.2 38.94,6.25 36.98,6.25 34.77,8.46 U$3.P$25 | U$4.2 U$4.4 3.71,1.63 2.79,1.63 C18.1 2.77,1.7 2.11,2.36 2.11,7.47 C17.1 2.16,7.52 2.16,8.59 C16.1 2.16,8.64 2.16,9.65 C15.1 2.21,9.7 2.36,9.7 3.02,10.36 7.32,10.36 | C20.1 6.35,20.55 4.88,22.02 v4.88,24.92 4.88,27.36 3.53,28.7 3.53,30.02 U$6.2 U$6.4 | 27.53,12.22 26.87,12.88 U$1.16 26.82,12.93 26.82,13.66 U$1.P$1 | 27.53,12.22 27.89,11.86 29.13,11.86 C30.1 29.18,11.91 29.29,12.01 v30.2,12.01 | C31.2 23.24,5.66 21.95,5.66 C32.1 21.92,5.59 21.23,4.9 v20.24,4.9 | U$1.14 25.78,12.8 C29.2 25.83,11.28 26.59,11.28 27.53,12.22 | 13.08,10.08 14.78,11.79 Q2.2 14.83,11.86 14.83,12.19 17.02,14.38 17.02,16.54 18.09,17.6 18.54,17.6 U$1.56 19.36,17.63 | 13.08,10.08 12.93,9.93 12.62,9.93 Q1.2 12.55,9.96 11.66,9.96 10.54,11.07 | 10.54,11.07 10.54,11.76 C19.1 | 13.08,10.08 14.1,9.07 14.1,4.6 C26.2 14.12,4.55 14.2,4.47 Q6.2 16.66,4.52 17.37,5.23 v18.57,5.23
  Top 0.152: 19.36,17.63 22.86,17.63 U$1.P$1 | 19.36,17.63 19.36,20.88 19.13,21.11 18.62,21.11 U$1.49 18.54,21.16 18.24,21.46 v16.38,21.46 | 7.32,10.36 9.83,10.36 10.54,11.07 | v7.32,10.29 7.32,10.36
  Bottom 0.152: 33.22,23.6 33.22,24.74 31.39,26.57 U$9.P$17 | 33.22,23.6 33.22,18.34 U$2.1 33.22,18.26 33.22,14.48 31.37,12.62 31.37,12.01 | 33.22,23.6 v32.97,23.6 | JP1.MT2 41.4,2.9 38.76,5.54 JP1.GND | v40.66,1.45 40.66,2.08 41.38,2.79 JP1.MT2 | 39.6,13.13 41.4,11.33 JP1.MT1 41.43,10.79 42.6,9.63 42.6,4.55 41.22,3.17 JP1.MT2 | 39.6,13.13 38.99,13.74 38.02,13.74 37.31,14.45 C2.2 | 39.6,13.13 38.76,12.29 v38.12,12.29 38.08,12.24 38.08,12.12 36.75,10.79 35.48,10.79 U$3.9 35.41,10.77 35.41,10.21 U$3.P$26 34.7,9.58 33.78,9.58 U$3.P$23 33.71,9.58 32.74,9.58 U$3.P$22 | U$3.18 32.44,7.29 32.44,8.23 32.66,8.46 U$3.P$21 | U$3.P$21 32.38,8.28 U$3.20 31.42,8.33 30.73,9.02 30.73,9.98 31.37,10.62 31.37,12.01 | U$3.15 33.91,7.29 33.91,8.23 33.68,8.46 U$3.P$24 | U$3.P$21 32.74,8.46 33.6,8.46 U$3.P$24 | U$3.P$22 32.44,9.8 32.44,10.77 U$3.3 | U$3.P$21 32.66,8.53 32.66,9.5 U$3.P$22 | U$3.P$25 34.75,8.46 33.78,8.46 U$3.P$24 | C27.2 13.36,19.96 12.34,18.95 11.86,18.95 C3.1 11.84,18.87 11.66,18.69 11.66,17.73 11.84,17.55 11.84,16.97 D3.2 11.76,16.97 9.91,16.97 8.99,16.05 Q7.2 8.94,16 8.94,14.58 C21.2 9.14,14.28 8.64,13.77 8.64,11.63 7.3,10.3 | 7.3,10.3 6.93,9.93 6.1,9.93 U$8.33 | U$8.3 v4.88,24.92 5.16,24.97 5.16,26.16 5.31,26.31 14.45,26.31 15.14,25.63 | U$2.12 20.04,19.63 18.36,21.31 17.75,21.31 U$2.29 17.68,21.36 16.59,21.36 16.43,21.51 | 15.14,25.63 17.02,27.51 17.73,27.51 U$2.28 | 15.14,25.63 15.14,22.81 16.43,21.51 | v16.38,21.46 16.43,21.51 | v7.32,10.29 7.3,10.3 | v30.2,12.01 31.37,12.01 | v20.24,4.9 18.9,4.9 v18.57,5.23
  pour Bottom: 0.25,31.5 0.3,0.25 42.9,0.25 42.9,17.27 36.96,17.27 36.96,31.5
LED_0  (via drill 0.33)
  Top 0.152: D5.C 29.01,0.58 27.64,1.96 v25.96,1.96 | v29.21,14.17 29.21,15.01 28.6,15.62 U$1.21
  Bottom 0.152: v25.96,1.96 25.96,4.39 26.24,4.67 26.24,6.02 29.36,9.14 29.36,11.61 29.21,11.76 v29.21,14.17
LED_1  (via drill 0.33)
  Top 0.152: D6.C 20.27,0.79 v23.62,4.14 | v25.35,5.03 25.58,5.03 26.04,5.49 26.62,5.49 29.87,8.74 v30.2,8.74 | v30.79,11.4 30.79,13.87 28.55,16.1 27.61,16.1 U$1.22
  Bottom 0.152: v23.62,4.14 24.46,4.14 v25.35,5.03 | v30.2,8.74 30.2,10.82 v30.79,11.4
N$1  (via drill 0.33 pad 0.51)
  Top 0.152: v32.92,2.79 32.64,3.07 31.88,3.07 31.6,3.35 31.11,3.35 31.11,2.92 R5.1
  Bottom 0.152: U$3.12 35.43,7.26 35.43,6.76 35.31,6.63 35.23,6.63 34.75,6.15 34.75,5.26 32.92,3.43 v32.92,2.79
N$2  (via drill 0.33)
  Top 0.152: v39.95,5.31 40.13,5.49 42.6,5.49 D1.C | v39.95,7.92 41.15,9.12 R4.2
  Bottom 0.152: v39.95,7.92 v39.95,5.31
N$3  (via drill 0.33 pad 0.51)
  Top 0.152: D9.C 34.11,4.95 34.14,4.98 34.14,6.07 v34.16,6.07
  Bottom 0.152: v34.16,6.07 34.24,6.07 34.92,6.76 U$3.13
N$4
  Top 0.152: R3.2 D2.C
N$5  (via drill 0.33)
  Top 0.152: v37.01,15.32 36.09,14.4 R2.2
  Bottom 0.152: R1.1 38.46,14.45 37.59,15.32 v37.01,15.32 36.96,15.27 34.44,15.27 31.93,12.75 U$3.2
N$6
  Bottom 0.152: L1.1 27.74,4.98 30.02,7.26 31.9,7.26 U$3.19
N$7
  Top 0.152: C30.2 28.07,13.16 27.61,13.61 U$1.17
N$8
  Bottom 0.152: R13.2 12.55,6.02 13.34,6.02 14.15,6.83 Q4.3
N$9  (via drill 0.33)
  Top 0.152: v15.93,19.43 15.27,19.43 13.28,21.41 12.83,21.41 12.47,21.06 12.47,18.97 v13.99,17.45
  Bottom 0.152: C14.2 21.21,15.57 18.49,18.29 18.49,19.28 18.34,19.43 v15.93,19.43 | v13.99,17.45 13.99,16.05 D3.3
N$10  (via drill 0.33)
  Top 0.152: R4.1 38.61,9.12 36.78,10.95 36.45,10.95 v35.28,12.12
  Bottom 0.152: v35.28,12.12 34.44,11.28 34.44,10.77 U$3.7
N$11  (via drill 0.33)
  Top 0.152: R3.1 37.92,10.29 v36.68,11.53
  Bottom 0.152: v36.68,11.53 35.23,11.53 34.92,11.23 U$3.8
N$12  (via drill 0.33)
  Top 0.152: v32.59,11.79 32.05,11.25 32.05,6.86 31.11,5.92 31.11,4.7 R6.1
  Bottom 0.152: v32.59,11.79 32.59,11.56 32.92,11.23 U$3.4
N$13
  Top 0.152: R7.2 11.4,0.76 9.73,2.44 U$4.1 9.65,2.46 U$4.3
N$14  (via drill 0.33)
  Top 0.152: U$5.1 39.42,2.44 38.33,1.35 v38.2,1.35 37.11,2.44 34.29,2.44 U$5.3
  Bottom 0.152: v38.2,1.35 R8.2
N$15
  Top 0.152: U$6.3 8,27.64 R9.2 7.95,27.69 6.35,29.29 4.52,29.29 U$6.1
N$17
  Top 0.152: Q6.3 17.27,2.59 18.26,2.59 18.95,1.91 R10.2
N$19
  Top 0.152: R10.1 20.09,1.91 18.8,3.2 15.44,3.2 U$12.1
N$26
  Bottom 0.152: C4.2 9.09,20.14 7.85,21.39 6.1,21.39 U$8.10
N$27
  Bottom 0.152: C4.1 7.54,20.14 6.78,20.9 U$8.11
N$28  (via drill 0.33)
  Top 0.152: v4.29,22.66 3.2,23.75 C5.2
  Bottom 0.152: v4.29,22.66 4.29,21.51 5.38,20.42 6.1,20.42 U$8.12
N$29  (via drill 0.33)
  Top 0.152: C5.1 3.2,22.12 v3.71,21.61
  Bottom 0.152: v3.71,21.61 5.41,19.91 U$8.13
N$30  (via drill 0.33)
  Top 0.152: v4.88,19.63 2.54,21.97 2.03,21.97 C6.2
  Bottom 0.152: v4.88,19.63 5.18,19.63 5.38,19.43 6.1,19.43 U$8.14
N$31  (via drill 0.33)
  Top 0.152: v3.28,20.27 2.87,20.68 2.03,20.68 C6.1
  Bottom 0.152: v3.28,20.27 4.55,19 6.02,19 6.1,18.92 U$8.15
N$32
  Bottom 0.152: C7.2 7.09,18.72 6.78,18.41 U$8.16
N$33
  Bottom 0.152: C7.1 7.62,17.45 7.24,17.45 6.78,17.91 U$8.17
N$34  (via drill 0.33)
  Top 0.152: v4.88,18.41 3.89,19.41 3.2,19.41 C8.2
  Bottom 0.152: v4.88,18.41 4.88,17.93 5.38,17.42 6.1,17.42 U$8.18
N$35  (via drill 0.33)
  Top 0.152: v4.29,17.8 3.99,18.11 C8.1
  Bottom 0.152: v4.29,17.8 4.5,17.8 5.38,16.92 U$8.19
N$36  (via drill 0.33)
  Top 0.152: v7.54,16.28 7.54,16.59 6.91,17.22 2.97,17.22 2.26,17.93 2.03,17.93 C9.1
  Bottom 0.152: v7.54,16.28 6.91,16.28 6.81,16.38 6.1,16.38 U$8.20
N$37  (via drill 0.33)
  Top 0.152: v4.67,16.64 2.03,16.64 C9.2
  Bottom 0.152: v4.67,16.64 5.38,15.93 6.1,15.93 U$8.21
N$38  (via drill 0.33)
  Top 0.152: v4.7,15.77 3.2,15.77 C10.1
  Bottom 0.152: v4.7,15.77 5.03,15.77 5.38,15.42 U$8.22
N$39  (via drill 0.33)
  Top 0.152: v4.88,14.5 3.2,14.5 C10.2
  Bottom 0.152: v4.88,14.5 5,14.5 5.38,14.88 6.1,14.88 U$8.23
N$40
  Bottom 0.152: C11.1 7.24,14.86 6.81,14.43 6.1,14.43 U$8.24
N$41
  Bottom 0.152: C11.2 7.64,13.59 7.11,13.59 6.81,13.89 6.1,13.89 U$8.25
N$42  (via drill 0.33)
  Top 0.152: v3.1,13.46 2.39,14.17 2.03,14.17 C12.1
  Bottom 0.152: v3.1,13.46 6.04,13.46 U$8.26
N$43  (via drill 0.33)
  Top 0.152: v4.88,12.88 2.03,12.88 C12.2
  Bottom 0.152: v4.88,12.88 6.07,12.88 U$8.27
N$44  (via drill 0.33)
  Top 0.152: v3.4,12.29 2.16,11.05 C13.1
  Bottom 0.152: v3.4,12.29 5.99,12.29 6.1,12.39 U$8.28
N$45  (via drill 0.33)
  Top 0.152: v4.55,11.05 C13.2
  Bottom 0.152: v4.55,11.05 5.38,11.89 6.1,11.89 U$8.29
N$46
  Bottom 0.152: C3.2 11.86,20.24 10.29,20.24 8.64,21.89 6.1,21.89 U$8.9
N$47  (via drill 0.33)
  Top 0.152: R15.1 11.07,12.85 11.91,12.01 v12.93,12.01 | v13.39,7.98 12.34,7.98 9.45,5.08 AP2305.3
  Bottom 0.152: v12.93,12.01 12.93,8.43 v13.39,7.98
N$48
  Top 0.152: D5.A 26.42,0.58 R23.1
N$49
  Bottom 0.152: Q3.1 7.92,6.66 10.72,6.66 11.35,6.02 R12.1 11.35,6.1 R13.1
N$50  (via drill 0.33)
  Top 0.152: C20.2 6.35,21.69 7.42,21.69 R17.1 7.47,21.64 9.37,21.64 12.83,18.19 12.83,17.3 10.08,14.55 7.75,14.55 6.35,15.95 Q5.3 6.3,15.9 5.54,15.14 v2.34,15.14 | v3.68,6.55 4.39,5.84 5.11,5.84 5.28,6.02 6.2,6.02 AP2305.1
  Bottom 0.152: v3.68,6.55 3.68,8.13 2.34,9.47 v2.34,15.14
N$51
  Top 0.152: D6.A 16.1,0.79 R24.1
N$52  (via drill 0.33)
  Top 0.152: v8.59,18.87 8.59,19.2 R17.2
  Bottom 0.152: v8.59,18.87 9.58,17.88 Q7.3
PM_BIN
  Top 0.152: R21.2 24.66,26.98 | 24.66,26.98 26.64,26.98 28.02,28.35 28.55,28.35 U$9.1 | U$1.37 24.87,21.89 24.87,22.61 24.66,22.81 24.66,26.98
PM_GPOUT  (via drill 0.33 pad 0.51)
  Top 0.152: U$9.12 32.89,28.69 32.89,28.85 31.98,29.77 28.32,29.77 27.99,29.44 27.99,28.8 27.28,28.09 25.25,28.09 | 25.25,28.09 R22.2 | U$1.36 25.35,21.89 25.35,22.58 25.4,22.63 25.4,22.94 24.97,23.37 24.97,26.11 v25.25,26.39 | v25.25,28.04 25.25,28.09
  Bottom 0.152: v25.25,28.04 v25.25,26.39
PM_SCL  (via drill 0.33 pad 0.51)
  Top 0.152: U$9.11 32.59,27.99 33.45,27.99 34.16,28.7 34.16,29.41 | 34.16,29.41 34.04,29.54 | 34.16,29.41 34.24,29.49 34.24,30.05 34.21,30.07 28.19,30.07 27.69,29.57 27.69,28.93 27.15,28.4 26.39,28.4 | 26.39,28.4 25.7,28.4 25.27,28.83 23.6,28.83 R19.2 | v25.6,25.55 25.6,25.17 25.27,24.84 25.27,23.5 25.7,23.06 25.7,22.76 25.86,22.61 25.86,21.89 U$1.35 | 26.39,28.4 v26.39,28.68
  Bottom 0.152: v25.6,25.55 26.8,26.75 26.8,28.27 v26.39,28.68
PM_SDA  (via drill 0.33 pad 0.51)
  Top 0.152: R20.2 23.61,30.38 27.1,30.38 | 27.1,30.38 34.34,30.38 34.54,30.18 34.54,28.57 33.54,27.57 U$9.10 | v27.1,23.32 26.36,22.58 26.36,21.89 U$1.34 | 27.1,30.38 v27.1,29.16
  Bottom 0.152: v27.1,23.32 v27.1,29.16
PM_SRP
  Top 0.152: U$9.7 32.59,26.36 32.59,25.6 35.41,22.78 35.41,13.95 35.59,13.77 38.41,13.77 38.53,13.89 39.57,13.89 R18.1 | C23.1 40.28,11.94 40.28,13.16 R18.1 | R18.1 U$11.2
SENSOR_DATA
  Top 0.152: U$1.2 19.86,12.17 19.66,11.96 19.66,5.05 18.57,3.96 18.57,3.83 18.44,3.71 14.25,3.71 13.82,3.28 U$12.2
SENSOR_EN
  Top 0.152: U$1.1 19.36,5.18 18.62,4.45 17.93,4.45 Q6.1
SPI_CLK  (via drill 0.33 pad 0.51)
  Top 0.152: U$1.44 21.36,21.89 21.36,22.61 21.29,22.68 21.21,22.68 20.93,22.96 20.93,24.16 21.29,24.51 v21.21,24.51 | v7.32,24.51 v19.1,24.51
  Bottom 0.152: v19.1,24.51 v21.21,24.51 | v7.32,24.51 7.11,24.51 7.04,24.43 6.83,24.43 6.81,24.41 U$8.4
SPI_MISO  (via drill 0.33 pad 0.51)
  Top 0.152: U$1.43 21.87,21.89 21.87,22.58 21.84,22.61 21.84,23.27 v21.51,23.27 | v19.1,23.34 18.82,23.62 8.43,23.62 8.15,23.34 v7.32,23.34
  Bottom 0.152: v21.51,23.27 21.16,23.62 20.22,23.62 19.94,23.34 v19.1,23.34 | v7.32,23.34 6.88,23.34 6.81,23.42 U$8.6
SPI_MOSI  (via drill 0.33 pad 0.51)
  Top 0.152: U$1.42 22.35,21.89 22.35,22.61 22.66,22.91 22.66,24.21 v22.05,24.21 | v7.92,23.93 v19.71,23.93
  Bottom 0.152: v22.05,24.21 21.72,24.21 21.44,23.93 v19.71,23.93 | v7.92,23.93 6.83,23.93 6.81,23.9 U$8.5
SPYBY_RST  (via drill 0.33 pad 0.51)
  Top 0.152: v37.44,5.41 35.41,3.38 32,3.38 31.73,3.66 25.48,3.66 24.33,4.8 24.33,9.4 v23.8,9.93 | v18.75,13.01 18.75,13.64 U$1.64
  Bottom 0.152: v37.44,5.41 37.44,6.53 37.8,6.88 38.02,6.88 38.05,6.86 JP1.D+ | v23.8,9.93 23.8,10.31 21.11,13.01 v18.75,13.01
SPYBY_TEST  (via drill 0.33 pad 0.51)
  Top 0.152: v34.27,3.96 25.6,3.96 24.64,4.93 v24.64,9.91 | v17.6,15.85 17.88,16.13 18.59,16.13 U$1.59
  Bottom 0.152: 38.73,7.52 JP1.D- 38.66,7.52 38.05,7.52 38.02,7.54 37.13,6.66 37.13,6.45 36.75,6.45 v34.27,3.96 | v24.64,9.91 18.69,15.85 v17.6,15.85
UART_RX  (via drill 0.33 pad 0.51)
  Top 0.152: U$1.46 20.37,21.89 20.37,22.58 20.32,22.63 v20.32,29.11
  Bottom 0.152: v20.32,29.11 21.23,30.02 21.23,30.71 U$2.14
UART_TX  (via drill 0.33 pad 0.51)
  Top 0.152: U$1.45 20.85,21.89 20.85,22.61 20.62,22.84 20.62,27.43 v20.9,27.71
  Bottom 0.152: v20.9,27.71 19.74,28.88 19.74,29.72 20.04,30.02 20.04,30.71 U$2.13
VCC  (via drill 0.33)
  Top 0.152: C28.1 22.23,25.58 22.23,26.29 22.25,26.31 R21.1 22.3,27.03 R22.1 22.3,28.14 R19.1 22.3,29.29 R20.1 | U$1.40 23.37,21.89 23.37,23.93 22.78,24.51 22.58,24.51 22.23,24.87 22.23,25.53 C28.1 | v12.24,17.96 9.3,17.96 8.56,17.22 Q5.2 | R24.2 14.76,0.76 12.68,2.85 U$12.3 12.8,2.82 C26.1 12.75,4.14 AP2305.2 | C29.1 24.41,10.82 23.88,10.82 23.22,10.16 23.22,9.7 23.79,9.13 | v33.1,13.11 31.67,11.68 31.67,10.24 | 31.67,10.24 31.67,8.1 v30.07,6.5 | U$1.11 24.38,12.88 24.38,13.39 24.61,13.61 26.11,13.61 26.34,13.39 26.34,12.88 U$1.15 26.36,12.83 v26.36,11.86 | v21.39,25.35 22.17,25.35 C28.1 | v28.47,10.24 31.67,10.24 | 23.79,9.13 23.93,8.99 23.93,4.78 25.07,3.63 R23.2 | v23.75,9.09 23.79,9.13 | v14.45,18.19 14.45,17.8 14.58,17.68 14.58,14.96 14.48,14.86 v14.48,12.65
  Bottom 0.152: v12.24,17.96 12.95,18.67 C27.1 13.41,18.62 14.02,18.62 v14.45,18.19 | 22.07,8.28 v22.07,8.48 | R1.2 38.46,13.16 37.31,13.16 C2.1 37.26,13.11 v33.1,13.11 | v30.07,6.5 30.07,4.32 L1.2 | v21.39,25.35 21.72,25.35 22.63,24.43 22.63,20.09 21.29,18.75 21.29,18.39 U$2.11 21.26,18.31 21.26,17.93 22,17.2 22,15.14 25.27,11.86 v26.36,11.86 26.89,11.34 | v28.47,10.24 27.99,10.24 26.89,11.34 | 23.75,9.32 24.87,9.32 26.89,11.34 | 23.75,9.32 23.57,9.32 22.78,8.53 22.12,8.53 v22.07,8.48 | v23.75,9.09 23.75,9.32 | v14.48,12.65 14.48,11.94 15.42,11 15.42,7.19 15.98,6.63 17.3,6.63 | 17.3,6.63 20.19,6.63 20.75,6.07 21.21,6.07 22.02,6.88 22.02,8.23 v22.07,8.48 | U$12.3 12.7,2.85 14.99,5.13 17.14,5.13 17.3,5.28 17.3,6.63
VCC_R  (via drill 0.33 pad 0.51)
  Top 0.152: v28.27,25.73 27.81,26.19 27.81,26.7 27.89,26.77 U$9.5 | U$9.2 28.07,27.96 27.2,27.1 27.2,24.71 27.38,24.54 27.99,24.54 v28.27,24.26 28.32,24.28 28.88,24.28 28.88,23.82 29.11,23.6 29.82,23.6 C25.1
  Bottom 0.152: v28.27,24.26 27.99,24.54 27.99,25.45 v28.27,25.73
VCC_T  (via drill 0.33)
  Top 0.152: R15.2 9.25,12.85 9.25,11.76 C19.2 9.17,11.73 7.92,11.73 v7.32,11.12
  Bottom 0.152: v7.32,11.12 7.01,11.12 6.81,10.92 6.1,10.92 U$8.31 U$8.32 6.04,10.36 4.78,10.36 3.86,9.45 3.86,8.64 4.27,8.23 4.27,4.6 4.78,4.09 13.39,4.09 15.16,5.87 16.36,5.87 Q4.2
VCOM  (via drill 0.33)
  Top 0.152: v4.88,6.43 5.08,6.43 5.44,6.78 8.41,6.78 8.46,6.73 10.06,6.73 v11.76,8.43
  Bottom 0.152: U$8.39 U$8.40 6.04,6.43 v4.88,6.43 | R14.2 10.54,12.17 10.54,13.23 R11.2 10.54,13.28 10.54,14.3 C21.1 10.59,13.95 11.61,13.95 12.34,13.21 12.34,10.44 11.76,9.86 v11.76,8.43
VCOM_DRIVER  (via drill 0.33)
  Top 0.152: v11.38,13.36 11.15,13.36 10.97,13.54 8.79,13.54 v7.32,12.06
  Bottom 0.152: R11.1 9.3,13.23 9.93,12.6 9.93,11.63 10.08,11.48 10.97,11.48 11.38,11.89 v11.38,13.36 | v7.32,12.06 7.32,11.94 6.81,11.43 6.1,11.43 U$8.30
VDH  (via drill 0.33)
  Top 0.152: Q1.3 5.66,9.27 4.69,8.29 | 4.69,8.29 3.91,7.52 C17.2 | 4.69,8.29 v4.88,8.1
  Bottom 0.152: v4.88,8.1 5.18,8.41 U$8.36
VDL  (via drill 0.33)
  Top 0.152: v5,4.67 3.28,2.95 C18.2
  Bottom 0.152: 7.04,7.95 6.12,7.95 6.1,7.92 U$8.37 | 7.04,7.95 7.9,7.95 Q3.2 7.98,7.92 10.19,7.92 10.79,7.32 11.35,7.32 R12.2 | v5,4.67 5.56,4.67 7.04,6.15 7.04,7.95
VGH  (via drill 0.33)
  Top 0.152: Q2.3 12.19,11.15 v11.73,10.69 | v4.88,9.65 C15.2
  Bottom 0.152: v11.73,10.69 11.73,10.54 10.62,9.42 6.1,9.42 U$8.34 6.04,9.47 5.33,9.47 5.16,9.65 v4.88,9.65
VGL  (via drill 0.33)
  Top 0.152: v4.45,8.87 4.17,8.59 C16.2 3.38,8.59 2.85,8.05 2.85,6.58 3.89,5.54 4.95,5.54 5.38,5.11 v7.21,5.11
  Bottom 0.152: v4.45,8.87 6.07,8.87 6.1,8.89 U$8.35 | v7.21,5.11 13.97,5.11 15.11,6.25 15.11,10.87 11.86,14.12 11.86,15.04 D3.1
VUSB  (via drill 0.33, 0.33 pad 0.51)
  Top 0.152: D2.A 42.62,8.76 42.6,8.74 D1.A 42.55,7.01 41.88,7.01 41.76,7.14 39.67,7.14 | v33.93,11.79 33.98,11.79 37.5,8.27 | 37.5,8.27 38.2,7.57 38.89,7.57 C1.1 38.99,7.54 39.52,7.54 39.67,7.39 39.67,7.14 | 37.5,8.27 v38.08,8.84 | v37.77,3.38 37.77,4.24 38.08,4.24 39.67,5.84 39.67,7.14 | v35.15,4.04 35.15,4.95 D9.A
  Bottom 0.152: v33.93,11.79 33.93,10.77 U$3.6 | v38.08,8.84 38.73,8.18 JP1.VBUS | v37.77,3.38 36.45,2.06 36.45,0.64 36.17,0.36 35.43,0.36 35.15,0.64 v35.15,4.04
XIN  (via drill 0.33)
  Top 0.152: U$1.12 24.84,12.88 24.84,12.37 22.91,10.44 22.91,8.51 21.95,7.54 C32.2 21.89,6.91 21.64,6.66 v20.98,6.66
  Bottom 0.152: v20.98,6.66 20.83,6.81 20.83,7.8 X1.4
XOUT  (via drill 0.33)
  Top 0.152: v20.98,5.49 20.98,5.82 21.41,6.25 22.38,6.25 23.06,6.93 23.24,6.93 C31.1 | v25.25,8.89 25.25,10.11 25.17,10.19 25.17,11.4 25.35,11.58 U$1.13
  Bottom 0.152: v20.98,5.49 21.69,5.49 24,7.8 X1.1 24.05,7.87 25.07,8.89 v25.25,8.89

### Text on the board
tNames: Bronson / Garrett / Tuan | PULSE.1